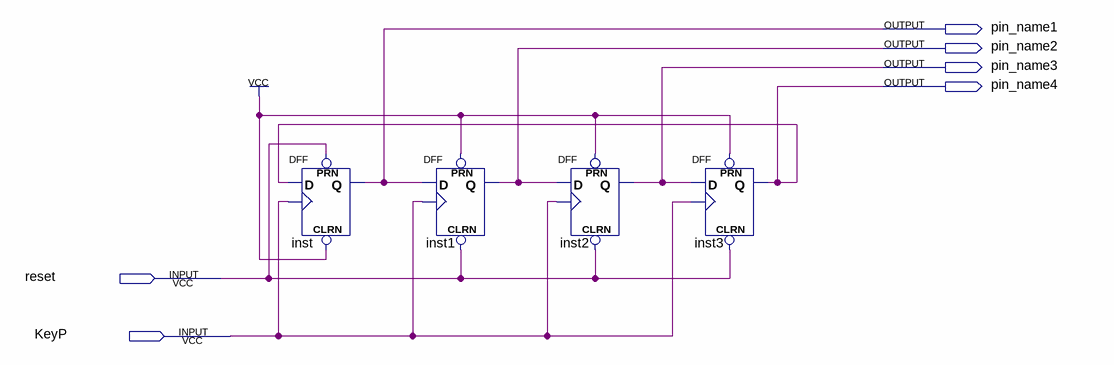
[diagram p0: schematic sheet]
// Quartus schematic Flipflop.bdf as structural Verilog: 4 symbols, 6 pins
module Flipflop (
  input  reset,
  input  KeyP,
  output pin_name1,
  output pin_name2,
  output pin_name3,
  output pin_name4
);

  DFF inst (.CLRN(1'b1), .CLK(KeyP), .D(pin_name4), .PRN(reset), .Q(pin_name1));
  DFF inst1 (.CLRN(reset), .CLK(KeyP), .D(pin_name1), .PRN(1'b1), .Q(pin_name2));
  DFF inst2 (.CLRN(reset), .CLK(KeyP), .D(pin_name2), .PRN(1'b1), .Q(pin_name3));
  DFF inst3 (.CLRN(reset), .CLK(KeyP), .D(pin_name3), .PRN(1'b1), .Q(pin_name4));
endmodule
